# EasyEDA schematic SCH_KB77_LCEDA.json
TITLE: KB77; REV: 1.0; Date: 2021-05-08; Sheet: 1/1; Company: K Workshop
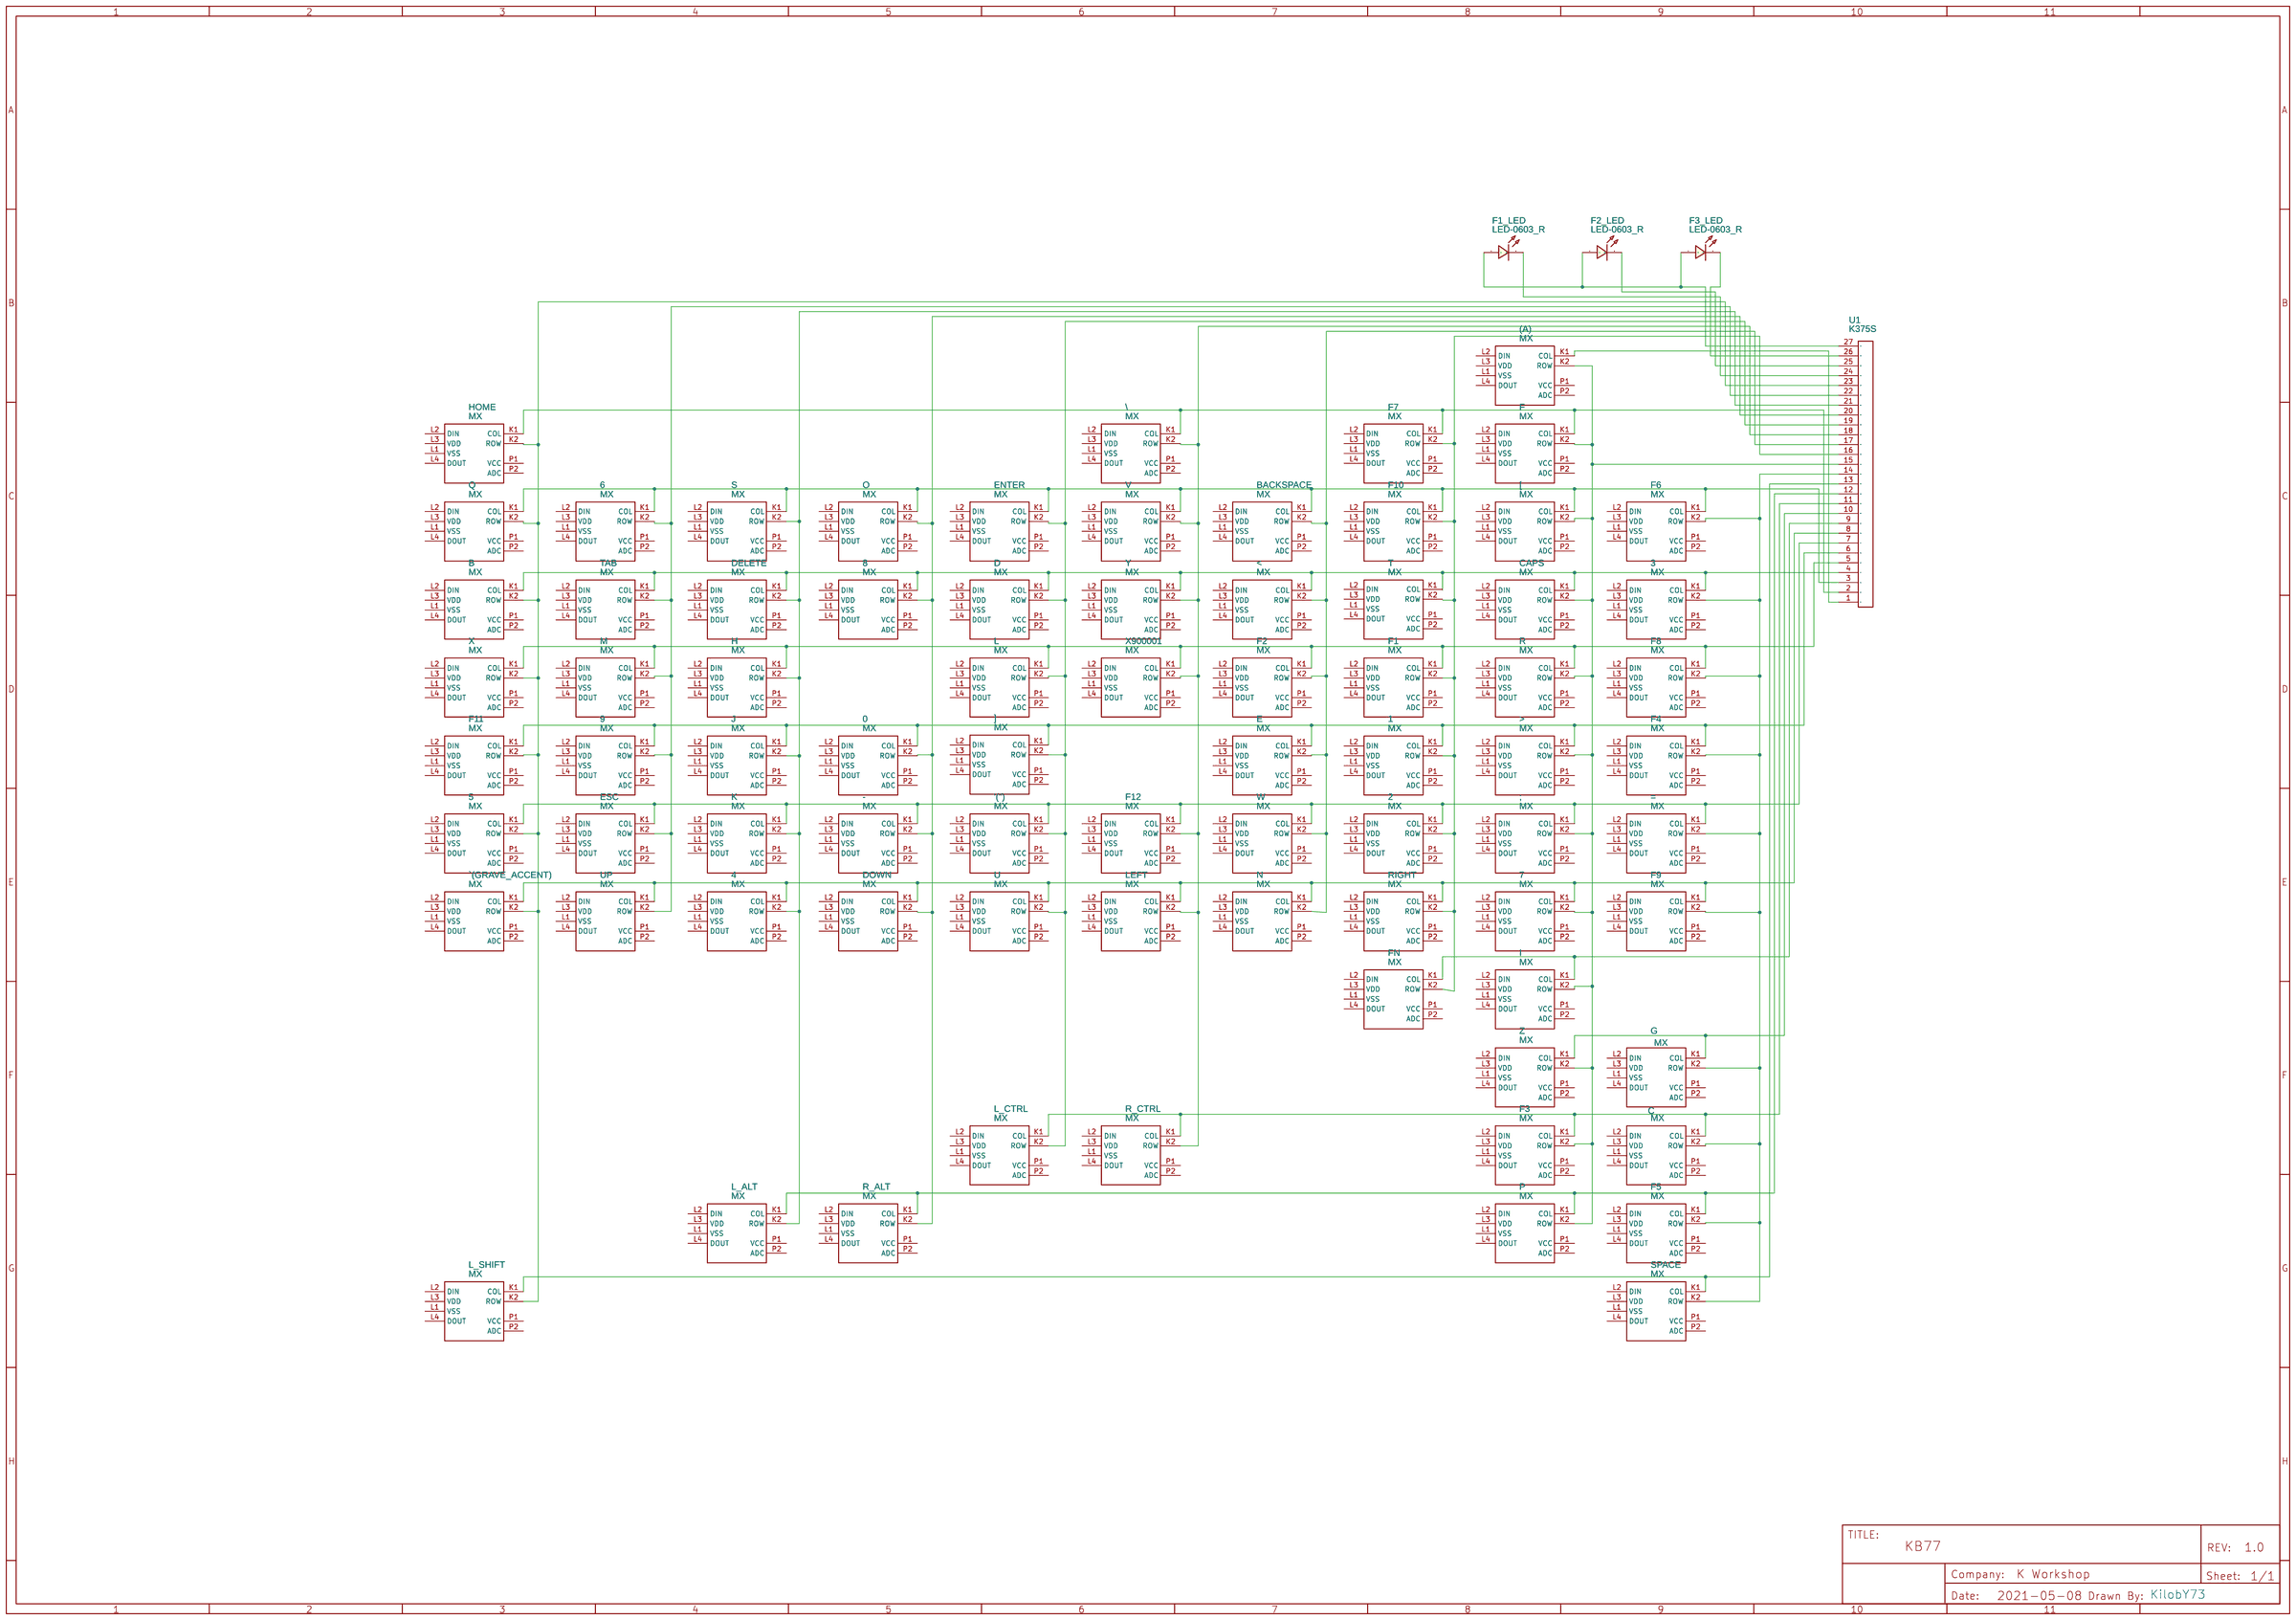
[diagram p0: schematic sheet]

## Parts
0  MX  [MX_CONTACT_POGOPIN_M1.4]
1  MX  [MX_CONTACT_POGOPIN_M1.4]
2  MX  [MX_CONTACT_POGOPIN_M1.4]
3  MX  [MX_CONTACT_POGOPIN_M1.4]
4  MX  [MX_CONTACT_POGOPIN_M1.4]
5  MX  [MX_CONTACT_POGOPIN_M1.4]
6  MX  [MX_CONTACT_POGOPIN_M1.4]
7  MX  [MX_CONTACT_POGOPIN_M1.4]
8  MX  [MX_CONTACT_POGOPIN_M1.4]
9  MX  [MX_CONTACT_POGOPIN_M1.4]
&#96;(GRAVE_ACCENT)  MX  [MX_CONTACT_POGOPIN_M1.4]
'(")  MX  [MX_CONTACT_POGOPIN_M1.4]
(A)  MX  [MX_CONTACT_POGOPIN_M1.4]
-  MX  [MX_CONTACT_POGOPIN_M1.4]
;  MX  [MX_CONTACT_POGOPIN_M1.4]
<  MX  [MX_CONTACT_POGOPIN_M1.4]
=  MX  [MX_CONTACT_POGOPIN_M1.4]
>  MX  [MX_CONTACT_POGOPIN_M1.4]
?#1  MX
[  MX  [MX_CONTACT_POGOPIN_M1.4]
\  MX  [MX_CONTACT_POGOPIN_M1.4]
]  MX  [MX_CONTACT_POGOPIN_M1.4]
`(GRAVE_ACCENT)  MX
B  MX  [MX_CONTACT_POGOPIN_M1.4]
BACKSPACE  MX  [MX_CONTACT_POGOPIN_M1.4]
C  MX  [MX_CONTACT_POGOPIN_M1.4]
CAPS  MX  [MX_CONTACT_POGOPIN_M1.4]
D  MX  [MX_CONTACT_POGOPIN_M1.4]
DELETE  MX  [MX_CONTACT_POGOPIN_M1.4]
DOWN  MX  [MX_CONTACT_POGOPIN_M1.4]
E  MX  [MX_CONTACT_POGOPIN_M1.4]
ENTER  MX  [MX_CONTACT_POGOPIN_M1.4]
ESC  MX  [MX_CONTACT_POGOPIN_M1.4]
F  MX  [MX_CONTACT_POGOPIN_M1.4]
F1  MX  [MX_CONTACT_POGOPIN_M1.4]
F1_LED  LED-0603_R  [LED0603_RED]
F2  MX  [MX_CONTACT_POGOPIN_M1.4]
F2_LED  LED-0603_R  [LED0603_RED]
F3  MX  [MX_CONTACT_POGOPIN_M1.4]
F3_LED  LED-0603_R  [LED0603_RED]
F4  MX  [MX_CONTACT_POGOPIN_M1.4]
F5  MX  [MX_CONTACT_POGOPIN_M1.4]
F6  MX  [MX_CONTACT_POGOPIN_M1.4]
F7  MX  [MX_CONTACT_POGOPIN_M1.4]
F8  MX  [MX_CONTACT_POGOPIN_M1.4]
F9  MX  [MX_CONTACT_POGOPIN_M1.4]
F10  MX  [MX_CONTACT_POGOPIN_M1.4]
F11  MX  [MX_CONTACT_POGOPIN_M1.4]
F12  MX  [MX_CONTACT_POGOPIN_M1.4]
FN  MX  [MX_CONTACT_POGOPIN_M1.4]
G  MX  [MX_CONTACT_POGOPIN_M1.4]
H  MX  [MX_CONTACT_POGOPIN_M1.4]
HOME  MX  [MX_CONTACT_POGOPIN_M1.4]
I  MX  [MX_CONTACT_POGOPIN_M1.4]
J  MX  [MX_CONTACT_POGOPIN_M1.4]
K  MX  [MX_CONTACT_POGOPIN_M1.4]
L  MX  [MX_CONTACT_POGOPIN_M1.4]
L_ALT  MX  [MX_CONTACT_POGOPIN_M1.4]
L_CTRL  MX  [MX_CONTACT_POGOPIN_M1.4]
L_SHIFT  MX  [MX_CONTACT_POGOPIN_M1.4]
LEFT  MX  [MX_CONTACT_POGOPIN_M1.4]
M  MX  [MX_CONTACT_POGOPIN_M1.4]
N  MX  [MX_CONTACT_POGOPIN_M1.4]
O  MX  [MX_CONTACT_POGOPIN_M1.4]
P  MX  [MX_CONTACT_POGOPIN_M1.4]
Q  MX  [MX_CONTACT_POGOPIN_M1.4]
R  MX  [MX_CONTACT_POGOPIN_M1.4]
R_ALT  MX  [MX_CONTACT_POGOPIN_M1.4]
R_CTRL  MX  [MX_CONTACT_POGOPIN_M1.4]
RIGHT  MX  [MX_CONTACT_POGOPIN_M1.4]
S  MX  [MX_CONTACT_POGOPIN_M1.4]
SPACE  MX  [MX_CONTACT_POGOPIN_M1.4]
T  MX  [MX_CONTACT_POGOPIN_M1.4]
TAB  MX  [MX_CONTACT_POGOPIN_M1.4]
U  MX  [MX_CONTACT_POGOPIN_M1.4]
U1  K375S  [K375S  27P]
UP  MX  [MX_CONTACT_POGOPIN_M1.4]
V  MX  [MX_CONTACT_POGOPIN_M1.4]
W  MX  [MX_CONTACT_POGOPIN_M1.4]
X  MX  [MX_CONTACT_POGOPIN_M1.4]
Y  MX  [MX_CONTACT_POGOPIN_M1.4]
Z  MX  [MX_CONTACT_POGOPIN_M1.4]

## Library data of the parts
0-9 &#96;(GRAVE_ACCENT) '(") (A) - ; < = > [ \ ] B BACKSPACE CAPS D DELETE DOWN E ENTER ESC F F1-F12 FN G H HOME I J K L L_ALT L_CTRL L_SHIFT LEFT M N O P Q R R_ALT R_CTRL RIGHT S SPACE T TAB U UP V W X Y Z = MX: Contributor: mugu
?#1 = MX_72
`(GRAVE_ACCENT) = MX_5
C = MX: Contributor: mugu; Package Display: No
F1_LED F2_LED F3_LED = LED-0603_R: Manufacturer: EVERLIGHT(台湾亿光); Manufacturer Part: 19-217/R6C-AL1M2VY/3T; Supplier Part: C72044; Supplier: LCSC; Contributor: LCEDA_01
U1 = K375S: Contributor: lkaill

## Nets
Net-(0-COL): 0.K1(COL) 1.K1(COL) 9.K1(COL) >.K1(COL) ].K1(COL) E.K1(COL) F4.K1(COL) F11.K1(COL) J.K1(COL) U1.6
Net-(1-ROW): 1.K2(ROW) 2.K2(ROW) F1.K2(ROW) F7.K2(ROW) F10.K2(ROW) FN.K2(ROW) RIGHT.K2(ROW) U1.16
Net-(3-COL): 3.K1(COL) 8.K1(COL) <.K1(COL) B.K1(COL) CAPS.K1(COL) D.K1(COL) DELETE.K1(COL) TAB.K1(COL) U1.4 Y.K1(COL)
Net-(3-ROW): 3.K2(ROW) =.K2(ROW) C.K2(ROW) F4.K2(ROW) F5.K2(ROW) F6.K2(ROW) F8.K2(ROW) F9.K2(ROW) G.K2(ROW) SPACE.K2(ROW) U1.14
Net-(4-COL): 4.K1(COL) 7.K1(COL) `(GRAVE_ACCENT).K1(COL) DOWN.K1(COL) F9.K1(COL) LEFT.K1(COL) N.K1(COL) RIGHT.K1(COL) U.K1(COL) U1.8 UP.K1(COL)
Net-(4-ROW): 4.K2(ROW) DELETE.K2(ROW) H.K2(ROW) J.K2(ROW) K.K2(ROW) L_ALT.K2(ROW) S.K2(ROW) U1.21
Net-(5-ROW): 5.K2(ROW) `(GRAVE_ACCENT).K2(ROW) B.K2(ROW) F11.K2(ROW) HOME.K2(ROW) L_SHIFT.K2(ROW) Q.K2(ROW) U1.23 X.K2(ROW)
Net-(6-COL): 6.K1(COL) [.K1(COL) BACKSPACE.K1(COL) ENTER.K1(COL) F6.K1(COL) F10.K1(COL) O.K1(COL) Q.K1(COL) S.K1(COL) U1.3 V.K1(COL)
Net-(6-ROW): 6.K2(ROW) 9.K2(ROW) ESC.K2(ROW) M.K2(ROW) TAB.K2(ROW) U1.22 UP.K2(ROW)
Net-('(")-COL): 2.K1(COL) 5.K1(COL) '(").K1(COL) -.K1(COL) ;.K1(COL) =.K1(COL) ESC.K1(COL) F12.K1(COL) K.K1(COL) U1.7 W.K1(COL)
Net-('(")-ROW): '(").K2(ROW) ].K2(ROW) D.K2(ROW) ENTER.K2(ROW) L.K2(ROW) L_CTRL.K2(ROW) U.K2(ROW) U1.19
Net-((A)-COL): (A).K1(COL) U1.1
Net-((A)-ROW): 7.K2(ROW) (A).K2(ROW) ;.K2(ROW) >.K2(ROW) [.K2(ROW) CAPS.K2(ROW) F.K2(ROW) F3.K2(ROW) I.K2(ROW) P.K2(ROW) R.K2(ROW) U1.15 Z.K2(ROW)
Net-(--ROW): 0.K2(ROW) 8.K2(ROW) -.K2(ROW) DOWN.K2(ROW) O.K2(ROW) R_ALT.K2(ROW) U1.20
Net-(<-ROW): <.K2(ROW) BACKSPACE.K2(ROW) E.K2(ROW) F2.K2(ROW) N.K2(ROW) U1.17 W.K2(ROW)
Net-(C-COL): C.K1(COL) F3.K1(COL) L_CTRL.K1(COL) R_CTRL.K1(COL) U1.11
Net-(F1-COL): ?#1.K1(COL) F1.K1(COL) F2.K1(COL) F8.K1(COL) H.K1(COL) L.K1(COL) M.K1(COL) R.K1(COL) U1.5 X.K1(COL)
Net-(F1_LED-Pad1): F1_LED.1 F2_LED.1 F3_LED.1 U1.27
Net-(F1_LED-Pad2): F1_LED.2 U1.24
Net-(F2_LED-Pad2): F2_LED.2 U1.25
Net-(F3_LED-Pad2): F3_LED.2 U1.26
Net-(F5-COL): F5.K1(COL) L_ALT.K1(COL) P.K1(COL) R_ALT.K1(COL) U1.12
Net-(F12-ROW): ?#1.K2(ROW) \.K2(ROW) F12.K2(ROW) LEFT.K2(ROW) R_CTRL.K2(ROW) U1.18 V.K2(ROW) Y.K2(ROW)
Net-(F-COL): \.K1(COL) F.K1(COL) F7.K1(COL) HOME.K1(COL) U1.2
Net-(FN-COL): FN.K1(COL) I.K1(COL) U1.9
Net-(G-COL): G.K1(COL) U1.10 Z.K1(COL)
Net-(L_SHIFT-COL): L_SHIFT.K1(COL) SPACE.K1(COL) U1.13

Not connected (* = marked no-connect by the designer): 0 L1(VSS) L2(DIN) L3(VDD) L4(DOUT) P1(VCC) P2(ADC); 1 L1(VSS) L2(DIN) L3(VDD) L4(DOUT) P1(VCC) P2(ADC); 2 L1(VSS) L2(DIN) L3(VDD) L4(DOUT) P1(VCC) P2(ADC); 3 L1(VSS) L2(DIN) L3(VDD) L4(DOUT) P1(VCC) P2(ADC); 4 L1(VSS) L2(DIN) L3(VDD) L4(DOUT) P1(VCC) P2(ADC); 5 L1(VSS) L2(DIN) L3(VDD) L4(DOUT) P1(VCC) P2(ADC); 6 L1(VSS) L2(DIN) L3(VDD) L4(DOUT) P1(VCC) P2(ADC); 7 L1(VSS) L2(DIN) L3(VDD) L4(DOUT) P1(VCC) P2(ADC); 8 L1(VSS) L2(DIN) L3(VDD) L4(DOUT) P1(VCC) P2(ADC); 9 L1(VSS) L2(DIN) L3(VDD) L4(DOUT) P1(VCC) P2(ADC); '(") L1(VSS) L2(DIN) L3(VDD) L4(DOUT) P1(VCC) P2(ADC); (A) L1(VSS) L2(DIN) L3(VDD) L4(DOUT) P1(VCC) P2(ADC); - L1(VSS) L2(DIN) L3(VDD) L4(DOUT) P1(VCC) P2(ADC); ; L1(VSS) L2(DIN) L3(VDD) L4(DOUT) P1(VCC) P2(ADC); < L1(VSS) L2(DIN) L3(VDD) L4(DOUT) P1(VCC) P2(ADC); = L1(VSS) L2(DIN) L3(VDD) L4(DOUT) P1(VCC) P2(ADC); > L1(VSS) L2(DIN) L3(VDD) L4(DOUT) P1(VCC) P2(ADC); ?#1 L1(VSS) L2(DIN) L3(VDD) L4(DOUT) P1(VCC) P2(ADC); [ L1(VSS) L2(DIN) L3(VDD) L4(DOUT) P1(VCC) P2(ADC); \ L1(VSS) L2(DIN) L3(VDD) L4(DOUT) P1(VCC) P2(ADC); ] L1(VSS) L2(DIN) L3(VDD) L4(DOUT) P1(VCC) P2(ADC); `(GRAVE_ACCENT) L1(VSS) L2(DIN) L3(VDD) L4(DOUT) P1(VCC) P2(ADC); B L1(VSS) L2(DIN) L3(VDD) L4(DOUT) P1(VCC) P2(ADC); BACKSPACE L1(VSS) L2(DIN) L3(VDD) L4(DOUT) P1(VCC) P2(ADC); C L1(VSS) L2(DIN) L3(VDD) L4(DOUT) P1(VCC) P2(ADC); CAPS L1(VSS) L2(DIN) L3(VDD) L4(DOUT) P1(VCC) P2(ADC); D L1(VSS) L2(DIN) L3(VDD) L4(DOUT) P1(VCC) P2(ADC); DELETE L1(VSS) L2(DIN) L3(VDD) L4(DOUT) P1(VCC) P2(ADC); DOWN L1(VSS) L2(DIN) L3(VDD) L4(DOUT) P1(VCC) P2(ADC); E L1(VSS) L2(DIN) L3(VDD) L4(DOUT) P1(VCC) P2(ADC); ENTER L1(VSS) L2(DIN) L3(VDD) L4(DOUT) P1(VCC) P2(ADC); ESC L1(VSS) L2(DIN) L3(VDD) L4(DOUT) P1(VCC) P2(ADC); F L1(VSS) L2(DIN) L3(VDD) L4(DOUT) P1(VCC) P2(ADC); F1 L1(VSS) L2(DIN) L3(VDD) L4(DOUT) P1(VCC) P2(ADC); F2 L1(VSS) L2(DIN) L3(VDD) L4(DOUT) P1(VCC) P2(ADC); F3 L1(VSS) L2(DIN) L3(VDD) L4(DOUT) P1(VCC) P2(ADC); F4 L1(VSS) L2(DIN) L3(VDD) L4(DOUT) P1(VCC) P2(ADC); F5 L1(VSS) L2(DIN) L3(VDD) L4(DOUT) P1(VCC) P2(ADC); F6 L1(VSS) L2(DIN) L3(VDD) L4(DOUT) P1(VCC) P2(ADC); F7 L1(VSS) L2(DIN) L3(VDD) L4(DOUT) P1(VCC) P2(ADC); F8 L1(VSS) L2(DIN) L3(VDD) L4(DOUT) P1(VCC) P2(ADC); F9 L1(VSS) L2(DIN) L3(VDD) L4(DOUT) P1(VCC) P2(ADC); F10 L1(VSS) L2(DIN) L3(VDD) L4(DOUT) P1(VCC) P2(ADC); F11 L1(VSS) L2(DIN) L3(VDD) L4(DOUT) P1(VCC) P2(ADC); F12 L1(VSS) L2(DIN) L3(VDD) L4(DOUT) P1(VCC) P2(ADC); FN L1(VSS) L2(DIN) L3(VDD) L4(DOUT) P1(VCC) P2(ADC); G L1(VSS) L2(DIN) L3(VDD) L4(DOUT) P1(VCC) P2(ADC); H L1(VSS) L2(DIN) L3(VDD) L4(DOUT) P1(VCC) P2(ADC); HOME L1(VSS) L2(DIN) L3(VDD) L4(DOUT) P1(VCC) P2(ADC); I L1(VSS) L2(DIN) L3(VDD) L4(DOUT) P1(VCC) P2(ADC); J L1(VSS) L2(DIN) L3(VDD) L4(DOUT) P1(VCC) P2(ADC); K L1(VSS) L2(DIN) L3(VDD) L4(DOUT) P1(VCC) P2(ADC); L L1(VSS) L2(DIN) L3(VDD) L4(DOUT) P1(VCC) P2(ADC); L_ALT L1(VSS) L2(DIN) L3(VDD) L4(DOUT) P1(VCC) P2(ADC); L_CTRL L1(VSS) L2(DIN) L3(VDD) L4(DOUT) P1(VCC) P2(ADC); L_SHIFT L1(VSS) L2(DIN) L3(VDD) L4(DOUT) P1(VCC) P2(ADC); LEFT L1(VSS) L2(DIN) L3(VDD) L4(DOUT) P1(VCC) P2(ADC); M L1(VSS) L2(DIN) L3(VDD) L4(DOUT) P1(VCC) P2(ADC); N L1(VSS) L2(DIN) L3(VDD) L4(DOUT) P1(VCC) P2(ADC); O L1(VSS) L2(DIN) L3(VDD) L4(DOUT) P1(VCC) P2(ADC); P L1(VSS) L2(DIN) L3(VDD) L4(DOUT) P1(VCC) P2(ADC); Q L1(VSS) L2(DIN) L3(VDD) L4(DOUT) P1(VCC) P2(ADC); R L1(VSS) L2(DIN) L3(VDD) L4(DOUT) P1(VCC) P2(ADC); R_ALT L1(VSS) L2(DIN) L3(VDD) L4(DOUT) P1(VCC) P2(ADC); R_CTRL L1(VSS) L2(DIN) L3(VDD) L4(DOUT) P1(VCC) P2(ADC); RIGHT L1(VSS) L2(DIN) L3(VDD) L4(DOUT) P1(VCC) P2(ADC); S L1(VSS) L2(DIN) L3(VDD) L4(DOUT) P1(VCC) P2(ADC); SPACE L1(VSS) L2(DIN) L3(VDD) L4(DOUT) P1(VCC) P2(ADC); T K1(COL) K2(ROW) L1(VSS) L2(DIN) L3(VDD) L4(DOUT) P1(VCC) P2(ADC); TAB L1(VSS) L2(DIN) L3(VDD) L4(DOUT) P1(VCC) P2(ADC); U L1(VSS) L2(DIN) L3(VDD) L4(DOUT) P1(VCC) P2(ADC); UP L1(VSS) L2(DIN) L3(VDD) L4(DOUT) P1(VCC) P2(ADC); V L1(VSS) L2(DIN) L3(VDD) L4(DOUT) P1(VCC) P2(ADC); W L1(VSS) L2(DIN) L3(VDD) L4(DOUT) P1(VCC) P2(ADC); X L1(VSS) L2(DIN) L3(VDD) L4(DOUT) P1(VCC) P2(ADC); Y L1(VSS) L2(DIN) L3(VDD) L4(DOUT) P1(VCC) P2(ADC); Z L1(VSS) L2(DIN) L3(VDD) L4(DOUT) P1(VCC) P2(ADC)

## Notes on the sheet
- KilobY73
